# Altium schematic sheet POWER_MUXES.SchDoc: =DocumentName
size C; SheetNumber: 4; SheetTotal: 8
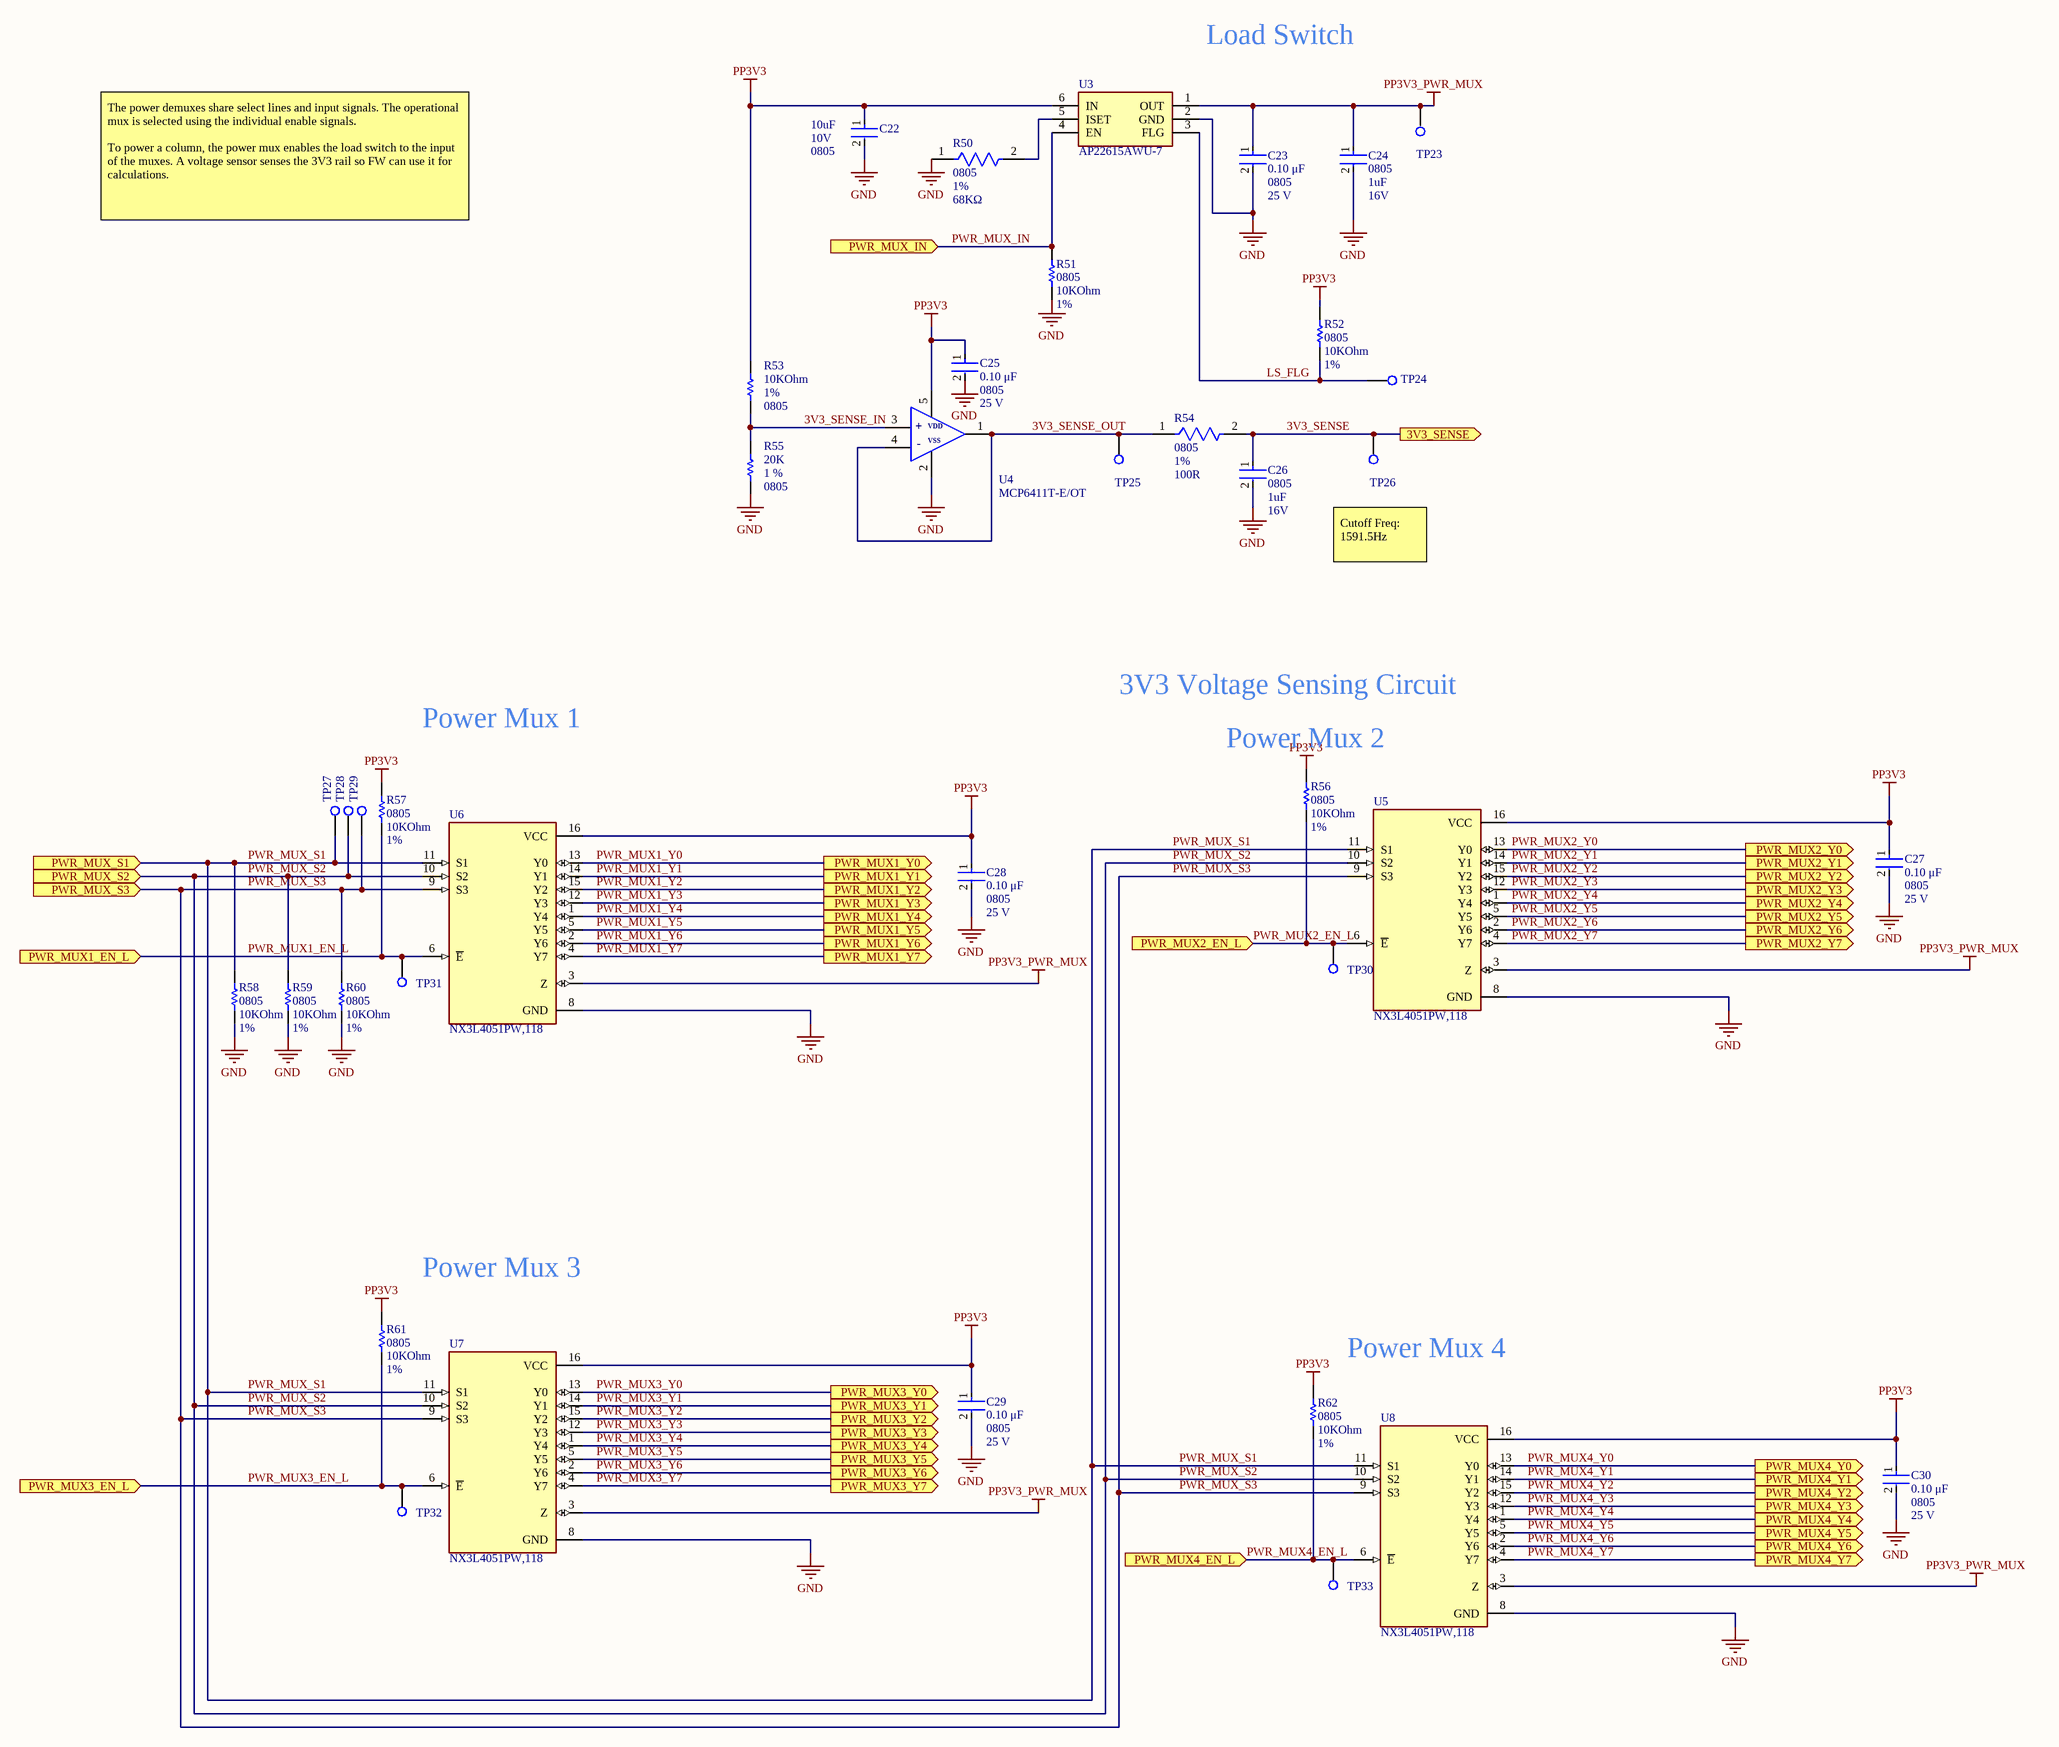
[diagram p0: POWER_MUXES.SchDoc]

## Parts
C22  Case/Package: 0805  Voltage Rating (DC): 10V  Capacitance: 10uF  [FP-GRM21B-0_15-IPC_A]  (hidden comment: GRM21BR71A106KA73K)
C23  Capacitance: 0.10 μF  Package: 0805  Voltage Rating: 25 V  [FP-C0805C-DN-IPC_B]  (hidden comment: C0805C104M3RACTU)
C24  Case/Package: 0805  Capacitance: 1uF  Voltage: 16V  [FP-CL21-IPC_A]  (hidden comment: CL21B105KOFNNNE)
C25  Capacitance: 0.10 μF  Package: 0805  Voltage Rating: 25 V  [FP-C0805C-DN-IPC_B]  (hidden comment: C0805C104M3RACTU)
C26  Case/Package: 0805  Capacitance: 1uF  Voltage: 16V  [FP-CL21-IPC_A]  (hidden comment: CL21B105KOFNNNE)
C27  Capacitance: 0.10 μF  Package: 0805  Voltage Rating: 25 V  [FP-C0805C-DN-IPC_B]  (hidden comment: C0805C104M3RACTU)
C28  Capacitance: 0.10 μF  Package: 0805  Voltage Rating: 25 V  [FP-C0805C-DN-IPC_B]  (hidden comment: C0805C104M3RACTU)
C29  Capacitance: 0.10 μF  Package: 0805  Voltage Rating: 25 V  [FP-C0805C-DN-IPC_B]  (hidden comment: C0805C104M3RACTU)
C30  Capacitance: 0.10 μF  Package: 0805  Voltage Rating: 25 V  [FP-C0805C-DN-IPC_B]  (hidden comment: C0805C104M3RACTU)
R50  Package Reference: 0805  Tolerance: 1%  Resistance: 68KΩ  [FP-CRGCQ0805-IPC_C]  (hidden comment: CRGCQ0805F68K)
R51  value 10KOhm  Package Reference: 0805  Tolerance: 1%  [RESC2013X50X30ML20T20]  (hidden comment: CRCW080515K0FKTA)
R52  value 10KOhm  Package Reference: 0805  Tolerance: 1%  [RESC2013X50X30ML20T20]  (hidden comment: CRCW080515K0FKTA)
R53  value 10KOhm  PackageReference: 0805  Tolerance: 1%  [RESC2013X60X35NL10T20]  (hidden comment: RC0805FR-0710KL)
R54  Case Code (Imperial): 0805  Tolerance: 1%  Resistance: 100R  [FP-RMCF0805-IPC_A]  (hidden comment: RMCF0805FT100R)
R55  value 20K  Tolerance: 1 %  Case-EIA: 0805  [RESC0805(2012)_N]  (hidden comment: 20K 1% 0805(2012))
R56  value 10KOhm  Package Reference: 0805  Tolerance: 1%  [RESC2013X50X30ML20T20]  (hidden comment: CRCW080515K0FKTA)
R57  value 10KOhm  Package Reference: 0805  Tolerance: 1%  [RESC2013X50X30ML20T20]  (hidden comment: CRCW080515K0FKTA)
R58  value 10KOhm  Package Reference: 0805  Tolerance: 1%  [RESC2013X50X30ML20T20]  (hidden comment: CRCW080515K0FKTA)
R59  value 10KOhm  Package Reference: 0805  Tolerance: 1%  [RESC2013X50X30ML20T20]  (hidden comment: CRCW080515K0FKTA)
R60  value 10KOhm  Package Reference: 0805  Tolerance: 1%  [RESC2013X50X30ML20T20]  (hidden comment: CRCW080515K0FKTA)
R61  value 10KOhm  Package Reference: 0805  Tolerance: 1%  [RESC2013X50X30ML20T20]  (hidden comment: CRCW080515K0FKTA)
R62  value 10KOhm  Package Reference: 0805  Tolerance: 1%  [RESC2013X50X30ML20T20]  (hidden comment: CRCW080515K0FKTA)
TP23  RCU-0C  [TP+195X110]  (value not drawn)
TP24  RCU-0C  [TP+195X110]  (value not drawn)
TP25  RCU-0C  [TP+195X110]  (value not drawn)
TP26  RCU-0C  [TP+195X110]  (value not drawn)
TP27  RCU-0C  [TP+195X110]  (value not drawn)
TP28  RCU-0C  [TP+195X110]  (value not drawn)
TP29  RCU-0C  [TP+195X110]  (value not drawn)
TP30  RCU-0C  [TP+195X110]  (value not drawn)
TP31  RCU-0C  [TP+195X110]  (value not drawn)
TP32  RCU-0C  [TP+195X110]  (value not drawn)
TP33  RCU-0C  [TP+195X110]  (value not drawn)
U3  AP22615AWU-7  [SOT95P280X100-6N]
U4  MCP6411T-E/OT  [SOT95P280X145-5N]
U5  NX3L4051PW,118  [SOP65P640X110-16N - duplicate]
U6  NX3L4051PW,118  [SOP65P640X110-16N - duplicate]
U7  NX3L4051PW,118  [SOP65P640X110-16N - duplicate]
U8  NX3L4051PW,118  [SOP65P640X110-16N - duplicate]

## Ports
3V3_SENSE (out), PWR_MUX1_EN_L (in), PWR_MUX1_Y0 (out), PWR_MUX1_Y1 (out), PWR_MUX1_Y2 (out), PWR_MUX1_Y3 (out), PWR_MUX1_Y4 (out), PWR_MUX1_Y5 (out), PWR_MUX1_Y6 (out), PWR_MUX1_Y7 (out), PWR_MUX2_EN_L (in), PWR_MUX2_Y0 (out), PWR_MUX2_Y1 (out), PWR_MUX2_Y2 (out), PWR_MUX2_Y3 (out), PWR_MUX2_Y4 (out), PWR_MUX2_Y5 (out), PWR_MUX2_Y6 (out), PWR_MUX2_Y7 (out), PWR_MUX3_EN_L (in), PWR_MUX3_Y0 (out), PWR_MUX3_Y1 (out), PWR_MUX3_Y2 (out), PWR_MUX3_Y3 (out), PWR_MUX3_Y4 (out), PWR_MUX3_Y5 (out), PWR_MUX3_Y6 (out), PWR_MUX3_Y7 (out), PWR_MUX4_EN_L (in), PWR_MUX4_Y0 (out), PWR_MUX4_Y1 (out), PWR_MUX4_Y2 (out), PWR_MUX4_Y3 (out), PWR_MUX4_Y4 (out), PWR_MUX4_Y5 (out), PWR_MUX4_Y6 (out), PWR_MUX4_Y7 (out), PWR_MUX_IN (in), PWR_MUX_S1 (in), PWR_MUX_S2 (in), PWR_MUX_S3 (in)

## Nets
GND: C22.2 C23.2 C24.2 C25.2 C26.2 C27.2 C28.2 C29.2 C30.2 R50.1 R51.2 R55.1 R58.1 R59.1 R60.1 U3.2(GND) U4.2(VSS) U5.8(GND) U6.8(GND) U7.8(GND) U8.8(GND)
PP3V3: C22.1 C25.1 C27.1 C28.1 C29.1 C30.1 R52.1 R53.2 R56.2 R57.2 R61.2 R62.2 U3.6(IN) U4.5(VDD) U5.16(VCC) U6.16(VCC) U7.16(VCC) U8.16(VCC)
PP3V3_PWR_MUX: C23.1 C24.1 TP23.1 U3.1(OUT) U5.3(Z) U6.3(Z) U7.3(Z) U8.3(Z)
3V3_SENSE: C26.1 R54.2 TP26.1 ; port 3V3_SENSE
3V3_SENSE_IN: R53.1 R55.2 U4.3(VIN+)
3V3_SENSE_OUT: R54.1 TP25.1 U4.1(VOUT) U4.4(VIN-)
LS_FLG: R52.2 TP24.1 U3.3(FLG)
PWR_MUX1_EN_L: R57.1 TP31.1 U6.6(~{E}) ; port PWR_MUX1_EN_L
PWR_MUX1_Y0: U6.13(Y0) ; port PWR_MUX1_Y0
PWR_MUX1_Y1: U6.14(Y1) ; port PWR_MUX1_Y1
PWR_MUX1_Y2: U6.15(Y2) ; port PWR_MUX1_Y2
PWR_MUX1_Y3: U6.12(Y3) ; port PWR_MUX1_Y3
PWR_MUX1_Y4: U6.1(Y4) ; port PWR_MUX1_Y4
PWR_MUX1_Y5: U6.5(Y5) ; port PWR_MUX1_Y5
PWR_MUX1_Y6: U6.2(Y6) ; port PWR_MUX1_Y6
PWR_MUX1_Y7: U6.4(Y7) ; port PWR_MUX1_Y7
PWR_MUX2_EN_L: R56.1 TP30.1 U5.6(~{E}) ; port PWR_MUX2_EN_L
PWR_MUX2_Y0: U5.13(Y0) ; port PWR_MUX2_Y0
PWR_MUX2_Y1: U5.14(Y1) ; port PWR_MUX2_Y1
PWR_MUX2_Y2: U5.15(Y2) ; port PWR_MUX2_Y2
PWR_MUX2_Y3: U5.12(Y3) ; port PWR_MUX2_Y3
PWR_MUX2_Y4: U5.1(Y4) ; port PWR_MUX2_Y4
PWR_MUX2_Y5: U5.5(Y5) ; port PWR_MUX2_Y5
PWR_MUX2_Y6: U5.2(Y6) ; port PWR_MUX2_Y6
PWR_MUX2_Y7: U5.4(Y7) ; port PWR_MUX2_Y7
PWR_MUX3_EN_L: R61.1 TP32.1 U7.6(~{E}) ; port PWR_MUX3_EN_L
PWR_MUX3_Y0: U7.13(Y0) ; port PWR_MUX3_Y0
PWR_MUX3_Y1: U7.14(Y1) ; port PWR_MUX3_Y1
PWR_MUX3_Y2: U7.15(Y2) ; port PWR_MUX3_Y2
PWR_MUX3_Y3: U7.12(Y3) ; port PWR_MUX3_Y3
PWR_MUX3_Y4: U7.1(Y4) ; port PWR_MUX3_Y4
PWR_MUX3_Y5: U7.5(Y5) ; port PWR_MUX3_Y5
PWR_MUX3_Y6: U7.2(Y6) ; port PWR_MUX3_Y6
PWR_MUX3_Y7: U7.4(Y7) ; port PWR_MUX3_Y7
PWR_MUX4_EN_L: R62.1 TP33.1 U8.6(~{E}) ; port PWR_MUX4_EN_L
PWR_MUX4_Y0: U8.13(Y0) ; port PWR_MUX4_Y0
PWR_MUX4_Y1: U8.14(Y1) ; port PWR_MUX4_Y1
PWR_MUX4_Y2: U8.15(Y2) ; port PWR_MUX4_Y2
PWR_MUX4_Y3: U8.12(Y3) ; port PWR_MUX4_Y3
PWR_MUX4_Y4: U8.1(Y4) ; port PWR_MUX4_Y4
PWR_MUX4_Y5: U8.5(Y5) ; port PWR_MUX4_Y5
PWR_MUX4_Y6: U8.2(Y6) ; port PWR_MUX4_Y6
PWR_MUX4_Y7: U8.4(Y7) ; port PWR_MUX4_Y7
PWR_MUX_IN: R51.1 U3.4(EN) ; port PWR_MUX_IN
PWR_MUX_S1: R58.2 TP27.1 U5.11(S1) U6.11(S1) U7.11(S1) U8.11(S1) ; port PWR_MUX_S1
PWR_MUX_S2: R59.2 TP28.1 U5.10(S2) U6.10(S2) U7.10(S2) U8.10(S2) ; port PWR_MUX_S2
PWR_MUX_S3: R60.2 TP29.1 U5.9(S3) U6.9(S3) U7.9(S3) U8.9(S3) ; port PWR_MUX_S3
NetR50_2: R50.2 U3.5(ISET)

## Notes on the sheet
- Load Switch
- The power demuxes share select lines and input signals. The operational mux is selected using the individual enable signals.
  To power a column, the power mux enables the load switch to the input of the muxes. A voltage sensor senses the 3V3 rail so FW can use it for calculations.
- Cutoff Freq: 1591.5Hz
- 3V3 Voltage Sensing Circuit
- Power Mux 1
- Power Mux 2
- (near R61) Power Mux 3
- (near R62) Power Mux 4
- Title
- Size:
- Date:
- File:
- C
- Number:
- Time:
- Revision:
- Sheet
- of
- (in symbol MCP6411T-E_OT) +; -

## Library data of the parts
C22 = CMP-06035-038134-1: Chip Multilayer Ceramic Capacitors for General Purpose, 0805, 10uF, X7R, 15%, 10%, 10V; Manufacturer: Murata Electronics; Dielectric: X7R; Thickness: 1.25mm; Tolerance: 10%; Length: 2mm; Width: 1.25mm; Manufacturer Part Number: GRM21BR71A106KA73K; Supplier Part Number: 490-14381-1-ND; Supplier: Digi-Key
C23 C25 C27-C30 = CMP-2007-00282-2: CAP CER 0.1UF 25V 20% X7R 0805; Manufacturer: KEMET; Temperature Coefficient: 30ppm/°C; Material: Ceramic; Tolerance: 0.2; Value: 0.10 μF; Digikey Description: CAP CER 0.1UF 25V 20% X7R 0805; Device Class L2: Capacitors; Temperature: -55°C to +125°C; Device Class L1: Passive Components; ComponentLink2Description: Datasheet; Mouser Description: Multilayer Ceramic Capacitors MLCC - SMD/SMT 25volts 0.1uF X7R 20%; Temperature Range High: +125°C; Device Class L3: Ceramic Capacitors; Automotive: No; Temperature Range Low: -55°C; RoHS: TRUE; Category: Cap; Lead Free: Yes; Ipc Land Pattern Name: CAPC200125X78; Height: 0.88mm; Temperature Characteristic: X7R; Octopart: https://octopart.com/c0805c104m3ractu-kemet-9138612; ComponentLink2URL: https://content.kemet.com/datasheets/KEM_C1003_C0G_SMD.pdf; Manufacturer Part Number: C0805C104M3RACTU; Supplier: Digi-Key; Supplier Part Number: 399-C0805C104M3RAC7800CT-ND
C24 C26 = CMP-13271-003098-1: CL21 Series 0805 1uF 16V ±10% Tolerance X7R Multilayer Ceramic Chip Capacitor; Manufacturer: Samsung Electro-Mechanics; Width: 0.049inch; Thickness: 0.053inch; Voltage Rating: 16V; Max Operating Temperature: 125°C; Case Code (Imperial): 0805; Height: 1.25mm; Length: 2mm; Lead Free: Lead Free; Mount: Surface Mount; Tolerance: 10%; Voltage Rating (DC): 16V; Min Operating Temperature: -55°C; Contact Plating: Tin; Depth: 1.25mm; Packaging: Tape and Reel; Package Quantity: 1; Dielectric: X7R; Radiation Hardening: No; Case Code (Metric): 2012; Manufacturer Part Number: CL21B105KOFNNNE; Supplier: Digi-Key; Supplier Part Number: 1276-1026-1-ND
R50 = CMP-03211-004185-1: CRGCQ0805 68KΩ 0.125W ±100ppm/°C 1% 150V; Manufacturer: TE Connectivity Passive Product; Temperature Coefficient: ±100ppm/°C; Height: 0.65mm; Composition: Thick Film; Package: CRGCQ0805; Temperature Range High: +155°C; ComponentLink2Description: Datasheet; Device Class L3: Chip SMD Resistors; Ipc Land Pattern Name: RESC200125X55; Temperature Range Low: -55°C; Category: Res; Automotive: Yes; Ambient Temperature Range High: +70°C; Power Rating: 0.125W; Octopart: https://octopart.com/crgcq0805f68k-te+connectivity-91018191; Lead Free: Yes; RoHS: TRUE; Automotive Grade: Grade 1103; Device Class L1: Passive Components; Voltage Rating: 150V; ComponentLink2URL: https://www.te.com/commerce/DocumentDelivery/DDEController?Action=showdoc&DocId=Data+Sheet%7F1773204-3%7F1%7Fpdf%7FEnglish%7FENG_DS_1773204-3_1.pdf%7F4-2176341-1112; Series: CRGCQ; Temperature: -55°C to +155°C; Manufacturer Part Number: CRGCQ0805F68K; Device Class L2: Resistors; Value: 68KΩ; Supplier: Digi-Key; Supplier Part Number: A129771CT-ND
R51 R52 R56-R62 = CMP-2001-04968-1: Manufacturer: Vishay Dale; Manufacturer Part Number: CRCW080515K0FKTA; Supplier: Digi-Key; Supplier Part Number: 541-3019-1-ND
R53 = CMP-1659-00013-4: Chip Resistor, 10 KOhm, +/- 1%, 0.125 W, -55 to 155 degC, 0805 (2012 Metric), RoHS, Tape and Reel; Manufacturer: Yageo; Voltage Rating: 150 V; Mount: Surface Mount; ComponentLink1Description: Manufacturer URL; ComponentLink2URL: http://www.yageo.com/documents/recent/PYu-RC_Group_51_RoHS_L_04.pdf; Pins: 2; Length: 2 mm; Min Operating Temperature: -55 degC; Height: 0.5 mm; Mounting Technology: Surface Mount; RoHSCompliant: true; REACH SVHC: No SVHC; ComponentLink1URL: http://www.yageo.com/; Max Operating Temperature: 155 degC; DatasheetVersion: Rev. 4, 02/2016; Package Quantity: 5000; Packaging: Tape and Reel; ComponentLink2Description: Datasheet; PackageDescription: 2-Pin Surface Mounted Device, Body 2 x 1.25 mm; Manufacturer Part Number: RC0805FR-0710KL; Supplier: Digi-Key; Supplier Part Number: RC0805FR-0710KL
R54 = CMP-26527-001731-1: 100Ω ±1% 0.125W 0805 Thick Film Chip Resistor AEC-Q200 compliant; Manufacturer: Stackpole Electronics Inc; Power Rating: 250mW; Temperature Coefficient: 100ppm/°C; Max Power Dissipation: 125mW; Radiation Hardening: No; RoHS Compliant: Yes; Depth: 1.25mm; Length: 2mm; Min Operating Temperature: -55°C; Series: RMCF; Packaging: Tape and Reel; Features: Automotive AEC-Q200; Height: 0.026inch; Size Code: 0805; Number of Terminations: 2; Max Operating Temperature: 155°C; Case/Package: 0805; Width: 0.049inch; Contact Plating: Tin; Resistor Type: Thick Film; Construction: Rectangular; Lead Free: Lead Free; Military Standard: Not; Case Code (Metric): 2012; Mount: Surface Mount; Manufacturer Part Number: RMCF0805FT100R; Supplier: Digi-Key; Supplier Part Number: RMCF0805FT100RCT-ND
R55 = CMP-1013-00655-1: 20K 0.125W 1% 0805 (2012 Metric)  SMD; Manufacturer Part Number: RC0805FR-0720KL; Manufacturer: YAGEO; Case-Metric: 2012; Power: 0.125 W; Technology: SMT; Supplier: Digi-Key; Supplier Part Number: 311-20.0KCRCT-ND
TP23-TP33 = RCU-0C: Natural PC Test Point , Plating Surface Mount Mounting Type; Manufacturer: TE Connectivity AMP Connectors; Value: *; Package: SON-6 TE Connectivity AMP Connectors; Purchase-URL: https://pricing.snapeda.com/search/part/RCU-0C/?ref=eda; Supplier Part Number: A106145CT-ND; Check_prices: https://www.snapeda.com/parts/RCU-0C/TE%20Connectivity/view-part/4791537/?ref=eda; Manufacturer Part Number: RCU-0C; SnapEDA_Link: https://www.snapeda.com/parts/RCU-0C/TE%20Connectivity/view-part/4791537/?ref=snap; Supplier: Digi-Key
U3 = AP22615AWU-7: Integrated Circuit; Manufacturer: Diodes Inc.; Datasheet Link: https://www.diodes.com/assets/Datasheets/AP22815-615.pdf; Height: 1mm; Supplier: Digi-Key; Supplier Part Number: AP22615AWU-7DICT-ND; Arrow Part Number: AP22615AWU-7; Arrow Price/Stock: https://www.arrow.com/en/products/ap22615awu-7/diodes-incorporated; Manufacturer Part Number: AP22615AWU-7
U4 = MCP6411T-E_OT: IC OPAMP GP 1 CIRCUIT SOT23-5; Manufacturer: Microchip; Datasheet Link: http://ww1.microchip.com/downloads/en/DeviceDoc/20005791B.pdf; Height: 1.45mm; Manufacturer Part Number: MCP6411T-E/OT; Mouser Part Number: 579-MCP6411T-E/OT; Mouser Price/Stock: https://www.mouser.com/Search/Refine.aspx?Keyword=579-MCP6411T-E%2FOT; Arrow Part Number: MCP6411T-E/OT; Arrow Price/Stock: https://www.arrow.com/en/products/mcp6411t-eot/microchip-technology; Supplier: Digi-Key; Supplier Part Number: MCP6411T-E/OTCT-ND
U5-U8 = NX3L4051PW,118: 1 Circuit IC Switch 8:1 750mOhm 16-TSSOP; MF: NXP USA; Check_prices: https://www.snapeda.com/parts/NX3L4051PW,118/NXP%20USA%20Inc./view-part/648693/?ref=eda; SnapEDA_Link: https://www.snapeda.com/parts/NX3L4051PW,118/NXP%20USA%20Inc./view-part/648693/?ref=snap; Package: TSSOP-16 NXP USA; MP: NX3L4051PW,118; Value: *; Digi-Key_Part_Number: 568-12393-1-ND; Purchase-URL: https://pricing.snapeda.com/search/part/NX3L4051PW,118/?ref=eda